# EAGLE schematic tda7266-7x7w (EAGLE 6.2)
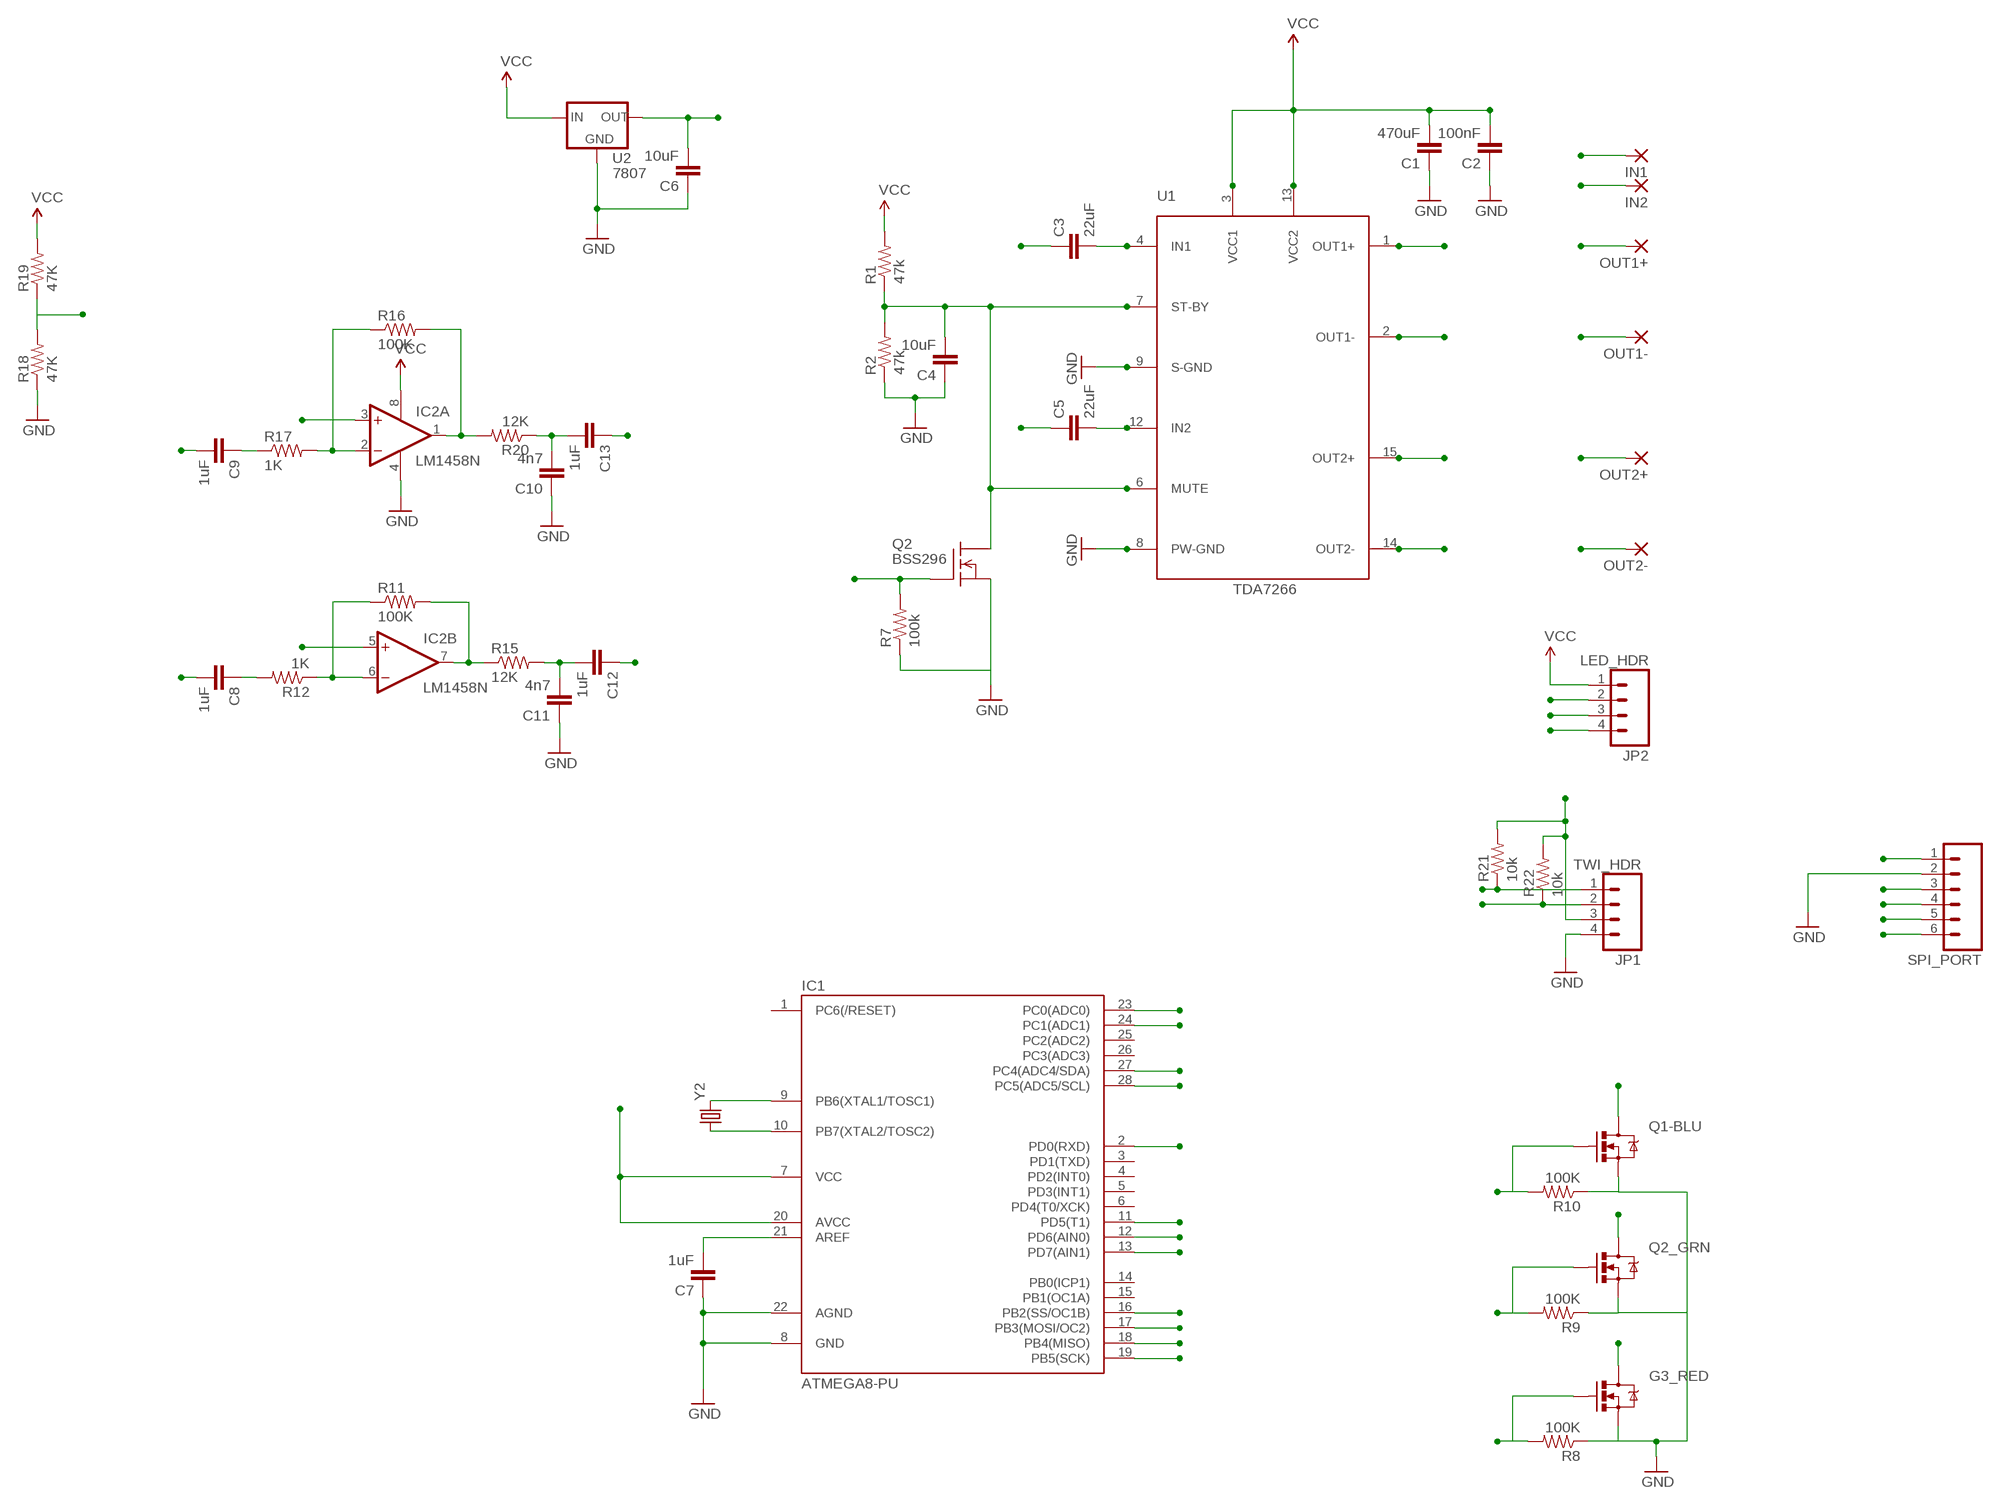
[diagram p0: schematic, sheet 1]

## Parts
C1  470uF  CAPPTH  [CAP-PTH-SMALL]
C2  100nF  CAPPTH  [CAP-PTH-SMALL]
C3  22uF  CAPPTH  [CAP-PTH-SMALL]
C4  10uF  CAPPTH  [CAP-PTH-SMALL]
C5  22uF  CAPPTH  [CAP-PTH-SMALL]
C6  10uF  CAPPTH  [CAP-PTH-SMALL]
C7  1uF  CAPPTH  [CAP-PTH-SMALL]
C8  1uF  CAPPTH  [CAP-PTH-SMALL]
C9  1uF  CAPPTH  [CAP-PTH-SMALL]
C10  4n7  CAPPTH  [CAP-PTH-SMALL]
C11  4n7  CAPPTH  [CAP-PTH-SMALL]
C12  1uF  CAPPTH  [CAP-PTH-SMALL]
C13  1uF  CAPPTH  [CAP-PTH-SMALL]
G3_RED  MOSFET-NCHANNELPTH2  [TO220V]
IC1  ATMEGA8-PU  [DIL28-3]
IC2  LM1458N  [DIL08]
IN1  2,54/0,8  [2,54/0,8]
IN2  2,54/0,8  [2,54/0,8]
JP1  TWI_HDR  M04LONGPADS  [1X04_LONGPADS]
JP2  LED_HDR  M04LONGPADS  [1X04_LONGPADS]
OUT1+  2,54/0,8  [2,54/0,8]
OUT1-  2,54/0,8  [2,54/0,8]
OUT2+  2,54/0,8  [2,54/0,8]
OUT2-  2,54/0,8  [2,54/0,8]
Q1-BLU  MOSFET-NCHANNELPTH2  [TO220V]
Q2  BSS296  [TO92]
Q2_GRN  MOSFET-NCHANNELPTH2  [TO220V]
R1  47k  RESISTORPTH-1/6W  [1/6W-RES]
R2  47k  RESISTORPTH-1/6W  [1/6W-RES]
R7  100k  RESISTORPTH-1/6W  [1/6W-RES]
R8  100K  RESISTORPTH-1/6W  [1/6W-RES]
R9  100K  RESISTORPTH-1/6W  [1/6W-RES]
R10  100K  RESISTORPTH-1/6W  [1/6W-RES]
R11  100K  RESISTORPTH-1/6W  [1/6W-RES]
R12  1K  RESISTORPTH-1/6W  [1/6W-RES]
R15  12K  RESISTORPTH-1/6W  [1/6W-RES]
R16  100K  RESISTORPTH-1/6W  [1/6W-RES]
R17  1K  RESISTORPTH-1/6W  [1/6W-RES]
R18  47K  RESISTORPTH-1/6W  [1/6W-RES]
R19  47K  RESISTORPTH-1/6W  [1/6W-RES]
R20  12K  RESISTORPTH-1/6W  [1/6W-RES]
R21  10k  RESISTORPTH-1/6W  [1/6W-RES]
R22  10k  RESISTORPTH-1/6W  [1/6W-RES]
SPI_PORT  M06LONGPADS  [1X06_LONGPADS]
U1  TDA7266  TDA7266TDA7266-MW15  [MULTIWATT-15]
U2  7807  V_REG_78XXSINK  [TO220-IGO]
Y2  CRYSTALHC49US  [HC49US]

## Nets
5V: C6.2 IC1.7(VCC) IC1.20(AVCC) JP1.3 R21.2 R22.2 SPI_PORT.1 U2.OUT
/SCK: IC1.19(PB5(SCK)) SPI_PORT.3
/SS: IC1.16(PB2(SS/OC1B)) SPI_PORT.6
AUD_CTRL: IC1.2(PD0(RXD)) Q2.1(G) R7.2
AUDIO_1: C13.1 IC1.23(PC0(ADC0))
AUDIO_2: C12.1 IC1.24(PC1(ADC1))
BLU: IC1.13(PD7(AIN1)) Q1-BLU.1(G) R10.2
BLU_OUT: JP2.4 Q1-BLU.2(D)
GND: C1.1 C2.1 C4.1 C6.1 C7.1 C10.1 C11.1 G3_RED.3(S) IC1.8(GND) IC1.22(AGND) IC2.4(P:V-) JP1.4 Q1-BLU.3(S) Q2.3(S) Q2_GRN.3(S) R2.1 R7.1 R8.1 R9.1 R10.1 R18.1 SPI_PORT.2 U1.8(PW-GND) U1.9(S-GND) U2.GND
GRN: IC1.12(PD6(AIN0)) Q2_GRN.1(G) R9.2
GRN_OUT: JP2.3 Q2_GRN.2(D)
IN1: C3.1 C8.2 IN1.1(P)
IN2: C5.1 C9.2 IN2.1(P)
MISO: IC1.18(PB4(MISO)) SPI_PORT.4
MOSI: IC1.17(PB3(MOSI/OC2)) SPI_PORT.5
N$1: IC2.1(A:OUT) R16.2 R20.2
N$3: IC1.9(PB6(XTAL1/TOSC1)) Y2.2
N$5: C8.1 R12.2
N$6: IC1.10(PB7(XTAL2/TOSC2)) Y2.1
N$7: C11.2 C12.2 R15.2
N$11: C3.2 U1.4(IN1)
N$13: C5.2 U1.12(IN2)
N$14: C7.2 IC1.21(AREF)
N$15: IC2.2(A:-IN) R16.1 R17.2
N$16: C9.1 R17.1
N$19: C10.2 C13.2 R20.1
N$25: IC2.7(B:OUT) R11.2 R15.1
N$27: IC2.6(B:-IN) R11.1 R12.1
N$262344: C4.2 Q2.2(D) R1.1 R2.2 U1.6(MUTE) U1.7(ST-BY)
OUT1+: OUT1+.1(P) U1.1(OUT1+)
OUT1-: OUT1-.1(P) U1.2(OUT1-)
OUT2+: OUT2+.1(P) U1.15(OUT2+)
OUT2-: OUT2-.1(P) U1.14(OUT2-)
RED: G3_RED.1(G) IC1.11(PD5(T1)) R8.2
RED_OUT: G3_RED.2(D) JP2.2
SCL: IC1.28(PC5(ADC5/SCL)) JP1.2 R22.1
SDA: IC1.27(PC4(ADC4/SDA)) JP1.1 R21.1
V_DIV: IC2.3(A:+IN) IC2.5(B:+IN) R18.2 R19.1
VCC: C1.2 C2.2 IC2.8(P:V+) JP2.1 R1.2 R19.2 U1.3(VCC1) U1.13(VCC2) U2.IN
Unconnected: IC1.1(PC6(/RESET)) IC1.3(PD1(TXD)) IC1.4(PD2(INT0)) IC1.5(PD3(INT1)) IC1.6(PD4(T0/XCK)) IC1.14(PB0(ICP1)) IC1.15(PB1(OC1A)) IC1.25(PC2(ADC2)) IC1.26(PC3(ADC3))

## Library data of the parts
C1-C13 = SparkFun:CAP: Capacitor Standard 0603 ceramic capacitor, and 0.1" leaded capacitor.
G3_RED Q1-BLU Q2_GRN = SparkFun:MOSFET-NCHANNEL
IC1 = atmega8:ATMEGA8-PU
IC2 = linear:*1458: OP AMP
IN1 IN2 OUT1+ OUT1- OUT2+ OUT2- = wirepad:2,54/0,8: THROUGH-HOLE PAD
JP1 JP2 = SparkFun:M04: Header 4 Standard 4-pin 0.1" header. Use with straight break away headers (SKU : PRT-00116), right angle break away headers (PRT-00553), swiss pins (PRT-00743), machine pins (PRT-00117), and female headers (PRT-00115). Molex polarized connector foot print use with SKU : PRT-08231 with associated crimp pins and housings. 1MM SMD Version SKU: PRT-10208
Q2 = transistor-fet:BSS296: N-Channel Enhancement MOSFET not checked
R1 R2 R7-R12 R15-R22 = SparkFun:RESISTOR: Resistor Basic schematic elements and footprints for 0603, 1206, and PTH resistors.
SPI_PORT = SparkFun:M06: Header 6 Standard 6-pin 0.1" header. Use with straight break away headers (SKU : PRT-00116), right angle break away headers (PRT-00553), swiss pins (PRT-00743), machine pins (PRT-00117), and female headers (PRT-00115). Molex polarized connector foot print use with SKU : PRT-08094 with associated crimp pins and housings. NOTES ON THE VARIANTS LOCK and LOCK_LONGPADS... This footprint was designed to help hold the alignment of a through-hole component (i.e. 6-pin header) while soldering it into place. You may notice that each hole has been shifted either up or down by 0.005 of an inch from it's more standard position (which is a perfectly straight line). This slight alteration caused the pins (the squares in the middle) to touch the edges of the holes. Because they are alternating, it causes a "brace" to hold the component in place. 0.005 has proven to be the perfect amount of "off-center" position when using our standard breakaway headers. Although looks a little odd when you look at the bare footprint, once you have a header in there, the alteration is very hard to notice. Also, if you push a header all the way into place, it is covered up entirely on the bottom side. This idea of altering the position of holes to aid alignment will be further integrated into the Sparkfun Library for other footprints. It can help hold any component with 3 or more connection pins.
U1 = Synapseware:TDA7266
U2 = SparkFun:V_REG_78XX: Voltage Regulator Standard 7805 5V regulator. IGO (Input Ground Output). Spark Fun Electronics SKU : COM-00107
Y2 = SparkFun:CRYSTAL: Crystals Various standard crystals. Proven footprints. Spark Fun Electronics SKU : COM-00534